# EAGLE board BEP32_6panel_Seed_wdrills (EAGLE 6.5.0), part 1 of 4
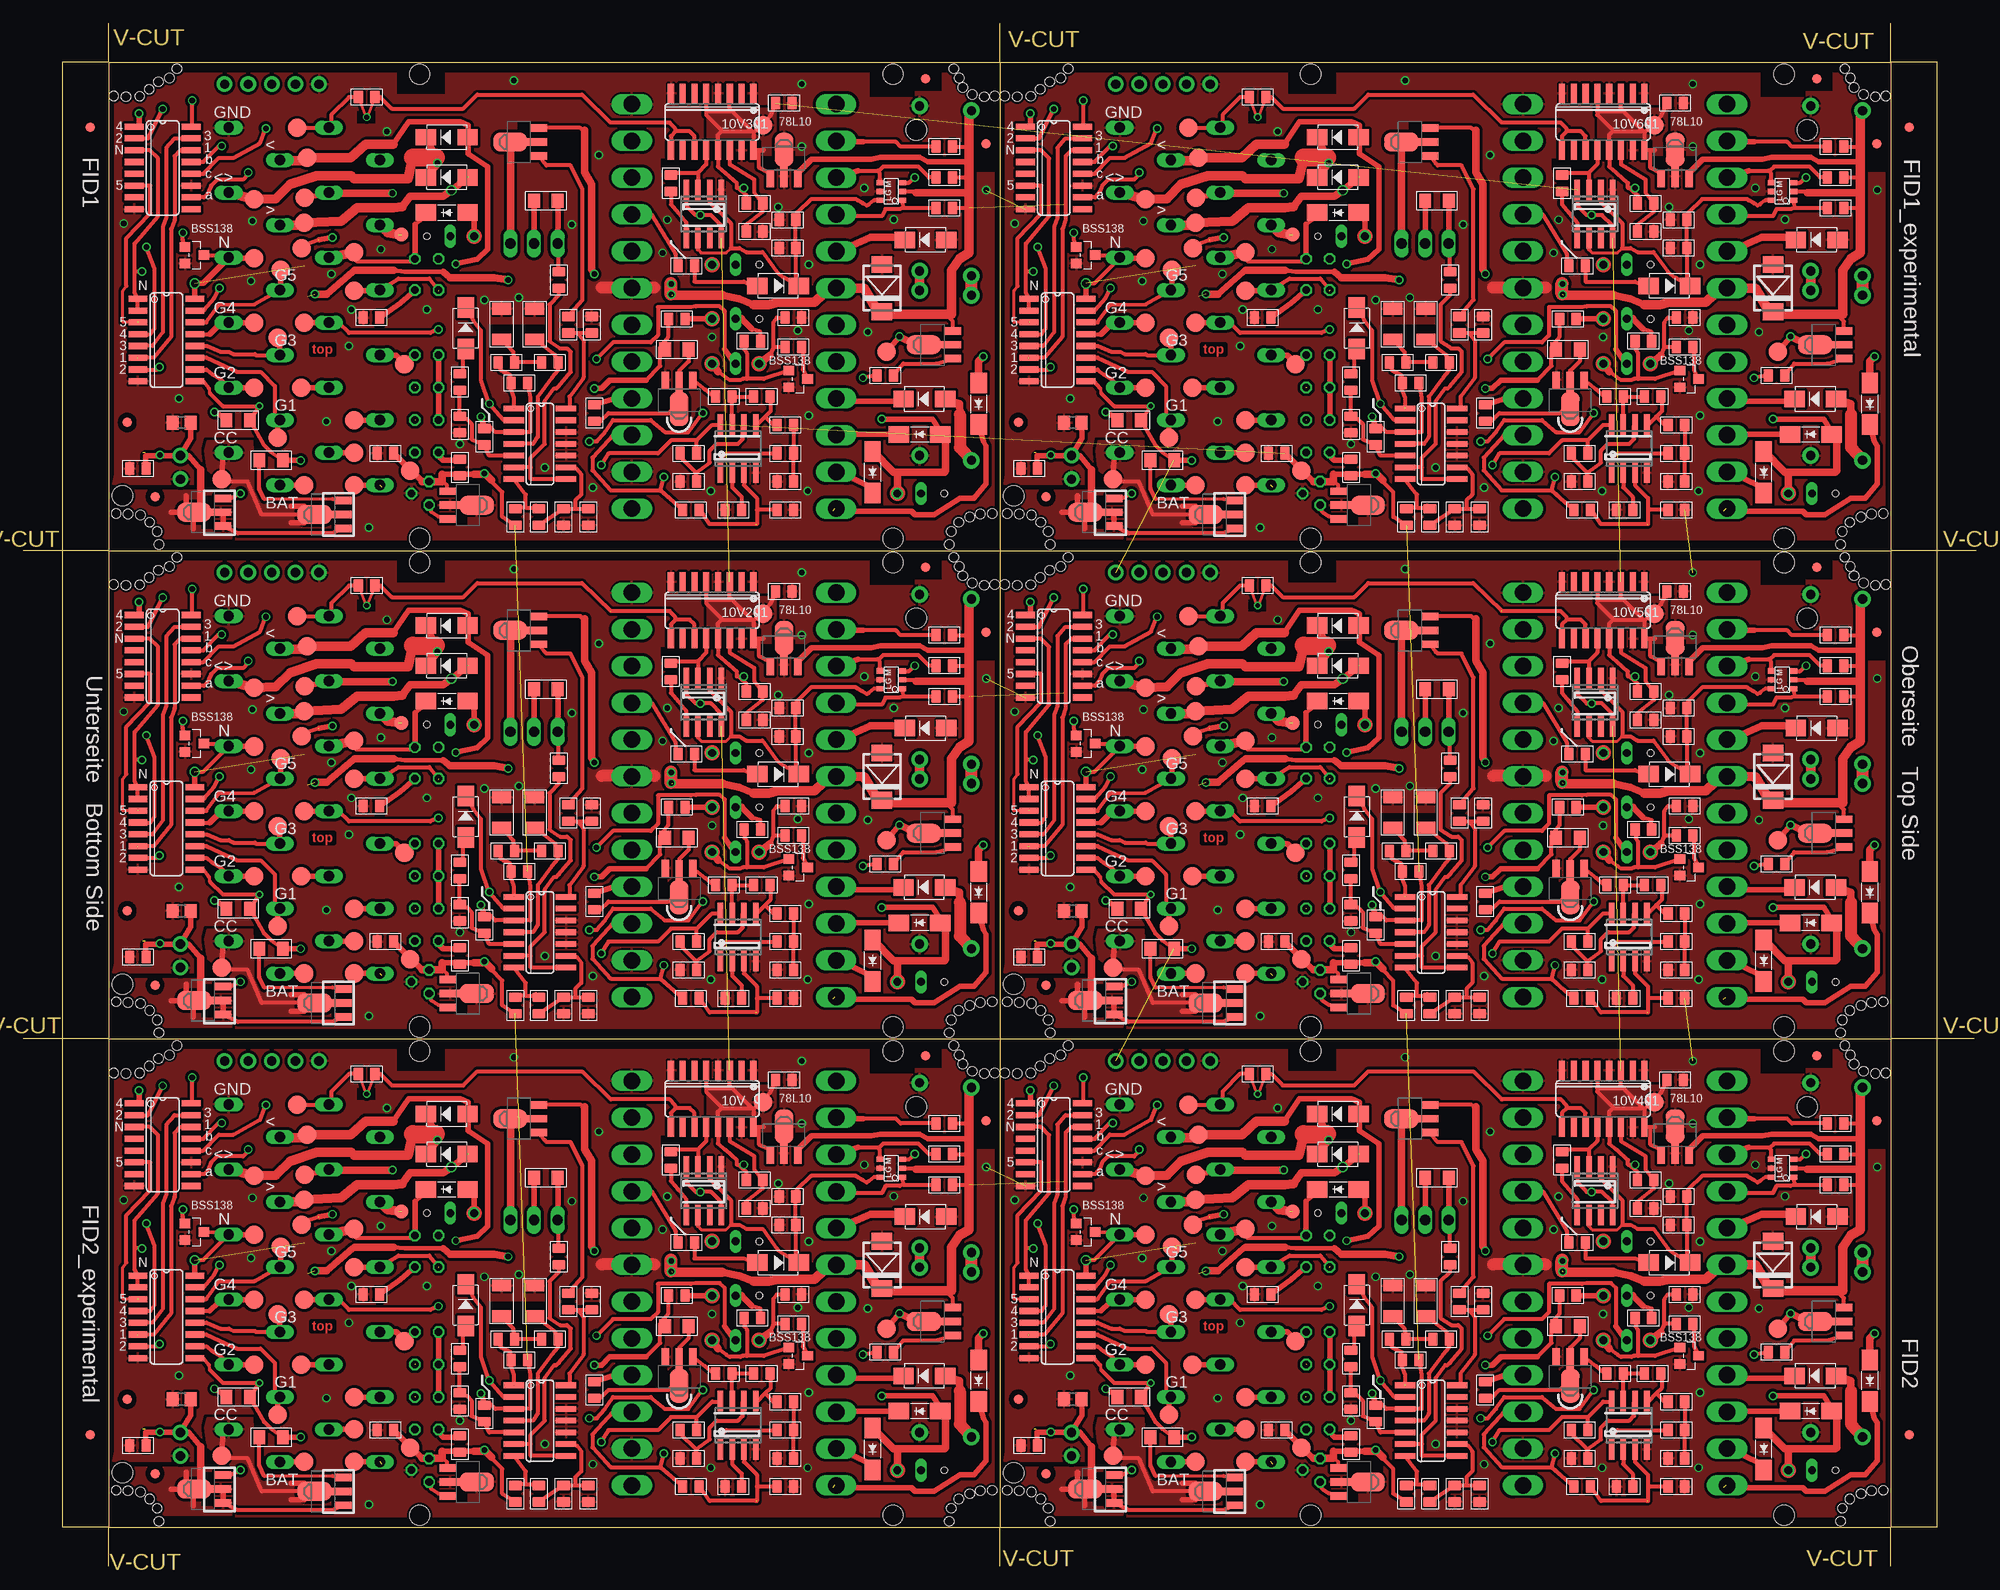
[diagram p12: board, top side]
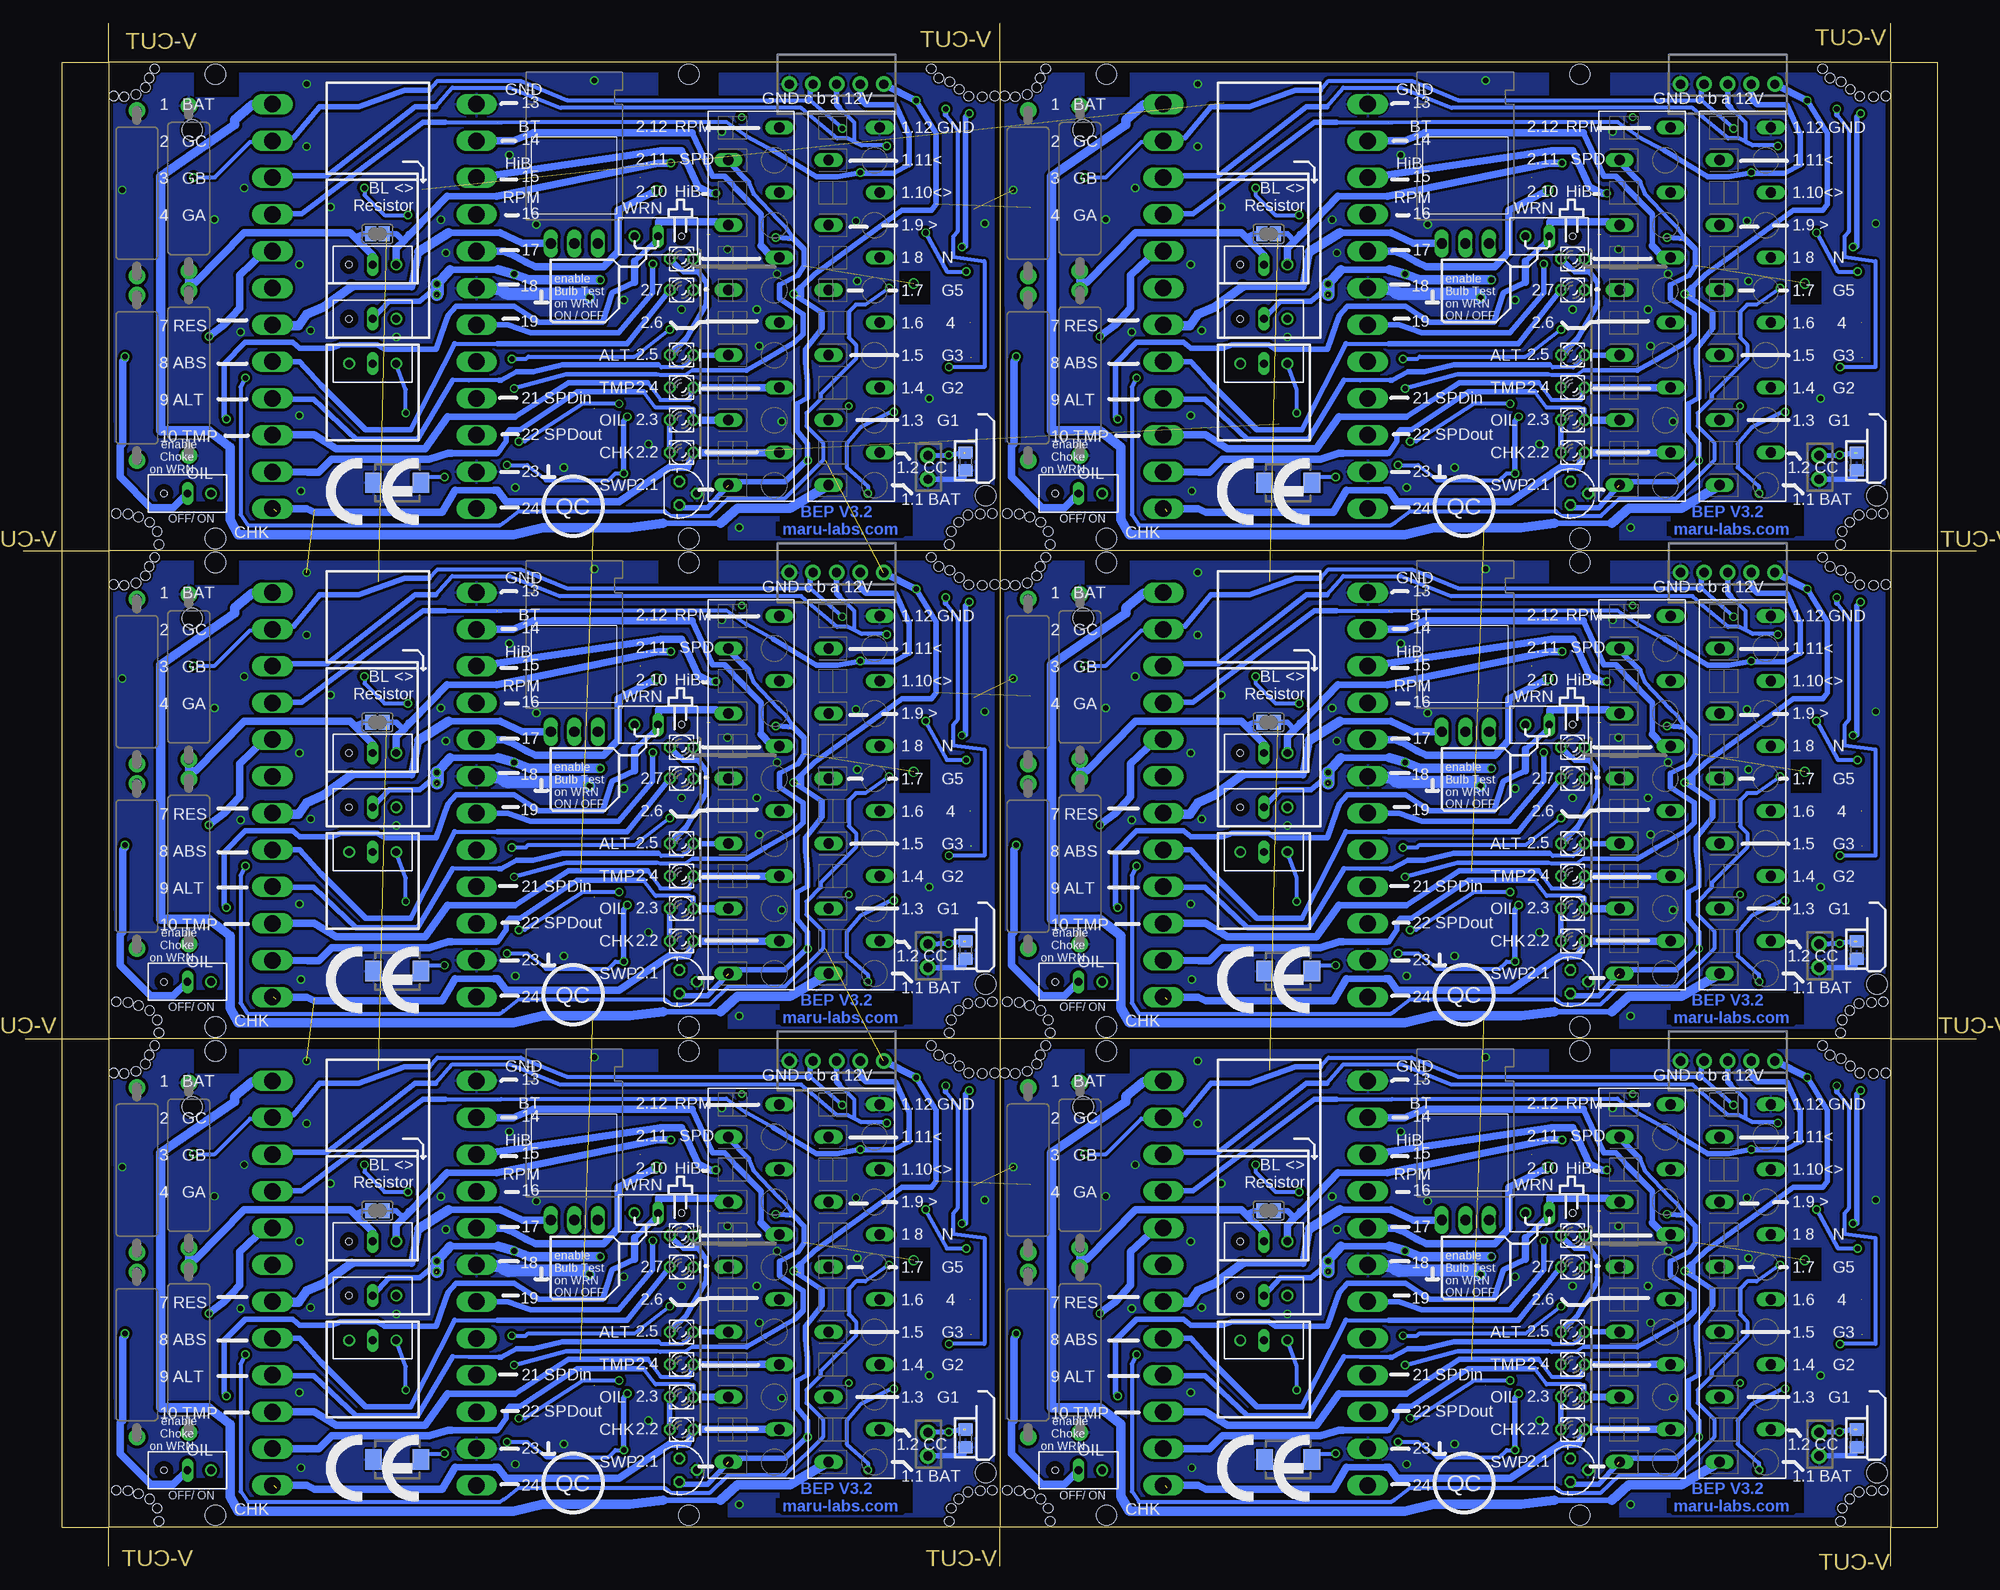
[diagram p13: board, bottom side, seen from below]

Size 210.4 x 166.2 mm. Coordinates in mm from the lower left corner, seen from the top.
Outline: 41 segments
Copper layers (1*16): Top 0.035mm / dielectric 1.5mm / Bottom 0.035mm
Design rules "Vorlage BEP3 und hoeher multi-cb_035um-cu": minimum track width 6mil, minimum drill 12mil, track to track 12mil, track to pad 12mil, pad to pad 6mil, via to via 6mil, smd to smd 6mil, copper to edge 10mil, drill to drill 8mil, minimum pad ring 8mil, minimum via ring 6mil, stop-mask expansion 3mil, vias tented up to drill 0mil, thermal gap 8mil
Holes 1.02 mm at 10.01,8.21 11.28,8.14 12.63,8.03 13.63,7.25 14.44,6.27 104.65,53.16 103.51,53.07 102.24,53.33 101.23,54.09 104.39,8.21 103.12,8.14 101.97,7.83 100.77,7.25 99.96,6.27 9.75,53.16 11.09,53.07 12.56,53.13 13.57,53.89 100.83,55.09 100.23,56.09 14.57,54.69 15.77,55.09 16.57,56.09 14.64,4.87 99.76,4.87 10.01,60.81 11.28,60.74 12.63,60.63 13.63,59.85 14.44,58.87 104.65,105.76 103.51,105.67 102.24,105.93 101.23,106.69 104.39,60.81 103.12,60.74 101.97,60.43 100.77,59.85 99.96,58.87 9.75,105.76 11.09,105.67 12.56,105.73 13.57,106.49 100.83,107.69 100.23,108.69 14.57,107.29 15.77,107.69 16.57,108.69 14.64,57.47 99.76,57.47 10.01,113.41 11.28,113.34 12.63,113.23 13.63,112.45 14.44,111.47 104.65,158.36 103.51,158.27 102.24,158.53 101.23,159.29 104.39,113.41 103.12,113.34 101.97,113.03 100.77,112.45 99.96,111.47 9.75,158.36 11.09,158.27 12.56,158.33 13.57,159.09 100.83,160.29 100.23,161.29 14.57,159.89 15.77,160.29 16.57,161.29 14.64,110.07 99.76,110.07 106.01,8.21 107.28,8.14 108.63,8.03 109.63,7.25 110.44,6.27 200.65,53.16 199.51,53.07 198.24,53.33 197.23,54.09 200.39,8.21 199.12,8.14 197.97,7.83 196.77,7.25 195.96,6.27 105.75,53.16 107.09,53.07 108.56,53.13 109.57,53.89 196.83,55.09 196.23,56.09 110.57,54.69 111.77,55.09 112.57,56.09 110.64,4.87 195.76,4.87 106.01,60.81 107.28,60.74 108.63,60.63 109.63,59.85 110.44,58.87 200.65,105.76 199.51,105.67 198.24,105.93 197.23,106.69 200.39,60.81 199.12,60.74 197.97,60.43 196.77,59.85 195.96,58.87 105.75,105.76 107.09,105.67 108.56,105.73 109.57,106.49 196.83,107.69 196.23,108.69 110.57,107.29 111.77,107.69 112.57,108.69 110.64,57.47 195.76,57.47 106.01,113.41 107.28,113.34 108.63,113.23 109.63,112.45 110.44,111.47 200.65,158.36 199.51,158.27 198.24,158.53 197.23,159.29 200.39,113.41 199.12,113.34 197.97,113.03 196.77,112.45 195.96,111.47 105.75,158.36 107.09,158.27 108.56,158.33 109.57,159.09 196.83,160.29 196.23,161.29 110.57,159.89 111.77,160.29 112.57,161.29 110.64,110.07 195.76,110.07
Holes 2.18 mm at 10.7,10.1 96.2,49.5 10.7,62.7 96.2,102.1 10.7,115.3 96.2,154.7 106.7,10.1 192.2,49.5 106.7,62.7 192.2,102.1 106.7,115.3 192.2,154.7
Holes 2.2 mm at 93.7,5.5 42.7,5.5 42.7,55.5 93.7,55.5 93.7,58.1 42.7,58.1 42.7,108.1 93.7,108.1 93.7,110.7 42.7,110.7 42.7,160.7 93.7,160.7 189.7,5.5 138.7,5.5 138.7,55.5 189.7,55.5 189.7,58.1 138.7,58.1 138.7,108.1 189.7,108.1 189.7,110.7 138.7,110.7 138.7,160.7 189.7,160.7
tRestrict: area 50.2,25.2 to 56.7,28.5; area 36,50.2 to 37.9,51.5; area 67.6,20.8 to 69.4,22.8; area 53.3,46.1 to 54.7,50.4; area 46.5,6.9 to 47.8,11.4; area 47.8,10.1 to 50.5,11.3; area 19.2,6.6 to 20.6,10.1; area 79.5,45.4 to 84.2,46.7; area 97.6,26.6 to 99.2,27.8; area 90.3,42.2 to 91.4,42.4; area 102.7,45 to 104.6,47.2; area 95.6,53.7 to 98.9,56.4; 78 more areas
bRestrict: area 18.6,5.8 to 28.8,9.3; area 28.7,5.8 to 33.3,7.3; area 38.5,5.1 to 45,7.3; area 39.5,53.3 to 46,55.7; area 90.8,5.7 to 96.8,9.5; area 16.7,30.7 to 20,34.3; area 91.2,53.1 to 96,56.1; area 18.6,58.4 to 28.8,62; area 28.7,58.4 to 33.3,59.9; area 38.5,57.7 to 45,59.9; area 39.5,105.9 to 46,108.3; area 90.8,58.3 to 96.8,62.1; 30 more areas

## Footprints (pad centres in the part's own frame; a part is rotated, then mirrored left to right if it is on the bottom)
12-PIN = drill 1.118 long: 1 19.25,-2.45; 2 15.75,3.05; 3 12.25,-2.45; 4 8.75,3.05; 5 5.25,-2.45; 6 1.75,3.05; 7 -1.75,-2.45; 8 -5.25,3.05; 9 -8.75,-2.45; 10 -12.25,3.05; 11 -15.75,-2.45; 12 -19.25,3.05
B2.0 = smd 2 x 2: TP 0,0
C0805 = smd 1.397 x 1.016: 1 0,0.889; 2 0,-0.889
C1206 = smd 1.27 x 2.032: 1 -1.651,0; 2 1.651,0
DO214AA = smd 1.8 x 2.2: A 2.55,0; C -2.55,0
DO-214AC = smd 2.2 x 1.77: 1 -2.242,0; 2 2.242,0
DO214AA_BI = smd 1.8 x 2.2: A 2.45,0; C -2.65,0
DO-214AC_SLIM = smd 2.2 x 1.77: 1 -2.242,0; 2 2.242,0
FIDUCIAL_1MM = smd 1 x 1: 1 0,0
FIDUCIAL_1MM_WITH_SOLDERMASK = smd 1 x 1: 1 0,0
SO08 = smd 0.6 x 2.2: 1 -1.905,-2.6; 2 -0.635,-2.6; 3 0.635,-2.6; 4 1.905,-2.6; 5 1.905,2.6; 6 0.635,2.6; 7 -0.635,2.6; 8 -1.905,2.6
SOT89_ROUND = smd 0.8 x 1.8: 1 -1.499,-2.181; 3 1.499,-2.181 | smd 0.8 x 2.3: 2 0,-1.927 | smd 2.032 x 3.65: 2@1 0,0.94
78LXX = drill 0.813 octagon: GND 0,1.905; IN 1.27,0; OUT -1.27,0
SO16 = smd 0.66 x 2.032: 1 -4.445,-3.073; 2 -3.175,-3.073; 3 -1.905,-3.073; 4 -0.635,-3.073; 5 0.635,-3.073; 6 1.905,-3.073; 7 3.175,-3.073; 8 4.445,-3.073; 9 4.445,3.073; 10 3.175,3.073; 11 1.905,3.073; 12 0.635,3.073; 13 -0.635,3.073; 14 -1.905,3.073; 15 -3.175,3.073; 16 -4.445,3.073
SOT457R_PHILIPS = smd 0.55 x 0.8: 1 -0.95,-1.2; 2 0,-1.2; 3 0.95,-1.2; 4 0.95,1.2; 5 0,1.2; 6 -0.95,1.2
SO14 = smd 0.6 x 2.2: 1 -3.81,-2.8; 2 -2.54,-2.8; 3 -1.27,-2.8; 4 0,-2.8; 5 1.27,-2.8; 6 2.54,-2.8; 7 3.81,-2.8; 8 3.81,2.8; 9 2.54,2.8; 10 1.27,2.8; 11 0,2.8; 12 -1.27,2.8; 13 -2.54,2.8; 14 -3.81,2.8
TO220H_NOHOLE = drill 1.118 long: 1 -2.54,-10.16; 2 0,-10.16; 3 2.54,-10.16
JP2_SMALLPADS = drill 0.85: 1 -2.54,0 | drill 0.85 long: 2 0,0 | hole 0.7: 2.54,0
JP2_ORIG_SMALLPADS = drill 0.85: 1 -2.54,0; 3 2.54,0 | drill 0.85 long: 2 0,0
LD260 = drill 0.813 octagon: A -1.27,0; K 1.27,0
SOT89 = smd 0.8 x 1.8: 1 -1.499,-2.181; 3 1.499,-2.181 | smd 0.8 x 2.3: 2 0,-1.927 | smd 2.032 x 3.65: 2@1 0,0.94
SOT-23 = smd 1.016 x 1.143: 1 -0.889,-1.016; 2 0.889,-1.016; 3 0,1.016
R0805 = smd 1.397 x 1.016: 1 0,0.889; 2 0,-0.889
R1206 = smd 1.27 x 1.524: 1 -1.27,0; 2 1.27,0
R0805' = smd 1.3 x 1.5: 1 -0.95,0; 2 0.95,0
V235/17_1MM = drill 1 pad 1.778: 1 -8.89,0; 2 8.89,0
SJ = smd 1.2 x 1.6: 1 -0.725,0; 2 0.725,0
B1,27 = smd 1.5 x 1.5: TP 0,0
24-PIN_V2 = drill 1.778 long: 1 -21.78,-11; 2 -17.82,-11; 3 -13.86,-11; 4 -9.9,-11; 5 -5.94,-11; 6 -1.98,-11; 7 1.98,-11; 8 5.94,-11; 9 9.9,-11; 10 13.86,-11; 11 17.82,-11; 12 21.78,-11; 13 -21.78,11; 14 -17.82,11; 15 -13.86,11; 16 -9.9,11; 17 -5.94,11; 18 -1.98,11; 19 1.98,11; 20 5.94,11; 21 9.9,11; 22 13.86,11; 23 17.82,11; 24 21.78,11
22-23-2021 = drill 1 pad 1.676: 1 -1.27,0; 2 1.27,0
22-23-2051 = drill 1 pad 1.676: 1 -5.08,0; 2 -2.54,0; 3 0,0; 4 2.54,0; 5 5.08,0

## Placement (x,y rotation side)
1  [12-PIN]  25.19,30.5 270 bottom
2  [12-PIN]  35.98,30.5 270 bottom
3  [12-PIN]  25.19,83.1 270 bottom
4  [12-PIN]  35.98,83.1 270 bottom
5  [12-PIN]  25.19,135.7 270 bottom
6  [12-PIN]  35.98,135.7 270 bottom
6V  TPSB2.0  [B2.0]  41.7,12.78 0 top
6V201  TPSB2.0  [B2.0]  41.7,65.38 0 top
6V301  TPSB2.0  [B2.0]  41.7,117.98 0 top
6V401  TPSB2.0  [B2.0]  137.7,12.78 0 top
6V501  TPSB2.0  [B2.0]  137.7,65.38 0 top
6V601  TPSB2.0  [B2.0]  137.7,117.98 0 top
10V  TPSB2.0  [B2.0]  79.7,50 0 top
10V201  TPSB2.0  [B2.0]  79.7,102.6 0 top
10V301  TPSB2.0  [B2.0]  79.7,155.2 0 top
10V401  TPSB2.0  [B2.0]  175.7,50 0 top
10V501  TPSB2.0  [B2.0]  175.7,102.6 0 top
10V601  TPSB2.0  [B2.0]  175.7,155.2 0 top
13  [12-PIN]  121.19,30.5 270 bottom
14  [12-PIN]  131.98,30.5 270 bottom
15  [12-PIN]  121.19,83.1 270 bottom
16  [12-PIN]  131.98,83.1 270 bottom
17  [12-PIN]  121.19,135.7 270 bottom
18  [12-PIN]  131.98,135.7 270 bottom
C101  4.7u  [C0805]  82.09,8.59 90 top
C102  100nF  [C0805]  81.96,52.4 90 top
C103  100nF,  [C0805]  82.09,11.64 270 top
C104  100nF,  [C0805]  39.03,14.68 270 top
C105  100nF.  [C0805]  58.21,7.83 0 top
C106  100nF.  [C0805]  61.26,28.53 0 top
C107  100u  [C1206]  51.54,28.59 90 top
C108  100u  [C1206]  55.1,28.59 90 top
C109  2.2nF  [C0805]  82.34,36.78 90 top
C110  100nF  [C0805]  78.78,38.56 90 top
C201  4.7u  [C0805]  82.09,61.19 90 top
C202  100nF  [C0805]  81.96,105 90 top
C203  100nF,  [C0805]  82.09,64.24 270 top
C204  100nF,  [C0805]  39.03,67.28 270 top
C205  100nF.  [C0805]  58.21,60.43 0 top
C206  100nF.  [C0805]  61.26,81.13 0 top
C207  100u  [C1206]  51.54,81.19 90 top
C208  100u  [C1206]  55.1,81.19 90 top
C209  2.2nF  [C0805]  82.34,89.38 90 top
C210  100nF  [C0805]  78.78,91.16 90 top
C301  4.7u  [C0805]  82.09,113.79 90 top
C302  100nF  [C0805]  81.96,157.6 90 top
C303  100nF,  [C0805]  82.09,116.84 270 top
C304  100nF,  [C0805]  39.03,119.88 270 top
C305  100nF.  [C0805]  58.21,113.03 0 top
C306  100nF.  [C0805]  61.26,133.73 0 top
C307  100u  [C1206]  51.54,133.79 90 top
C308  100u  [C1206]  55.1,133.79 90 top
C309  2.2nF  [C0805]  82.34,141.98 90 top
C310  100nF  [C0805]  78.78,143.76 90 top
C401  4.7u  [C0805]  178.09,8.59 90 top
C402  100nF  [C0805]  177.96,52.4 90 top
C403  100nF,  [C0805]  178.09,11.64 270 top
C404  100nF,  [C0805]  135.03,14.68 270 top
C405  100nF.  [C0805]  154.21,7.83 0 top
C406  100nF.  [C0805]  157.26,28.53 0 top
C407  100u  [C1206]  147.54,28.59 90 top
C408  100u  [C1206]  151.1,28.59 90 top
C409  2.2nF  [C0805]  178.34,36.78 90 top
C410  100nF  [C0805]  174.78,38.56 90 top
C501  4.7u  [C0805]  178.09,61.19 90 top
C502  100nF  [C0805]  177.96,105 90 top
C503  100nF,  [C0805]  178.09,64.24 270 top
C504  100nF,  [C0805]  135.03,67.28 270 top
C505  100nF.  [C0805]  154.21,60.43 0 top
C506  100nF.  [C0805]  157.26,81.13 0 top
C507  100u  [C1206]  147.54,81.19 90 top
C508  100u  [C1206]  151.1,81.19 90 top
C509  2.2nF  [C0805]  178.34,89.38 90 top
C510  100nF  [C0805]  174.78,91.16 90 top
C601  4.7u  [C0805]  178.09,113.79 90 top
C602  100nF  [C0805]  177.96,157.6 90 top
C603  100nF,  [C0805]  178.09,116.84 270 top
C604  100nF,  [C0805]  135.03,119.88 270 top
C605  100nF.  [C0805]  154.21,113.03 0 top
C606  100nF.  [C0805]  157.26,133.73 0 top
C607  100u  [C1206]  147.54,133.79 90 top
C608  100u  [C1206]  151.1,133.79 90 top
C609  2.2nF  [C0805]  178.34,141.98 90 top
C610  100nF  [C0805]  174.78,143.76 90 top
D101  SM6T  [DO214AA]  92.5,32.46 90 top
D102  1N4007,  [DO-214AC]  45.64,44.4 180 top
D103  1N4007,  [DO-214AC]  45.64,48.72 180 top
D104  SM6TDO214AA_BI  [DO214AA_BI]  74.21,11.51 180 bottom
D105  1N4007.  [DO-214AC]  97.2,37.67 180 top
D106  1N4007.  [DO-214AC]  97.07,20.53 180 top
D107  1N5817  [DO-214AC_SLIM]  96.56,16.72 180 top
D108  1N5817.  [DO-214AC_SLIM]  91.5,12.64 270 top
D109  1N5817.  [DO-214AC_SLIM]  102.93,20.01 270 top
D110  1N5817  [DO-214AC_SLIM]  45.64,40.59 180 top
D111  1N4007  [DO-214AC]  47.67,28.15 90 top
D112  1N4007  [DO-214AC]  81.32,32.72 0 top
D201  SM6T  [DO214AA]  92.5,85.06 90 top
D202  1N4007,  [DO-214AC]  45.64,97 180 top
D203  1N4007,  [DO-214AC]  45.64,101.32 180 top
D204  SM6TDO214AA_BI  [DO214AA_BI]  74.21,64.11 180 bottom
D205  1N4007.  [DO-214AC]  97.2,90.27 180 top
D206  1N4007.  [DO-214AC]  97.07,73.13 180 top
D207  1N5817  [DO-214AC_SLIM]  96.56,69.32 180 top
D208  1N5817.  [DO-214AC_SLIM]  91.5,65.24 270 top
D209  1N5817.  [DO-214AC_SLIM]  102.93,72.61 270 top
D210  1N5817  [DO-214AC_SLIM]  45.64,93.19 180 top
D211  1N4007  [DO-214AC]  47.67,80.75 90 top
D212  1N4007  [DO-214AC]  81.32,85.32 0 top
D301  SM6T  [DO214AA]  92.5,137.66 90 top
D302  1N4007,  [DO-214AC]  45.64,149.6 180 top
D303  1N4007,  [DO-214AC]  45.64,153.92 180 top
D304  SM6TDO214AA_BI  [DO214AA_BI]  74.21,116.71 180 bottom
D305  1N4007.  [DO-214AC]  97.2,142.87 180 top
D306  1N4007.  [DO-214AC]  97.07,125.73 180 top
D307  1N5817  [DO-214AC_SLIM]  96.56,121.92 180 top
D308  1N5817.  [DO-214AC_SLIM]  91.5,117.84 270 top
D309  1N5817.  [DO-214AC_SLIM]  102.93,125.21 270 top
D310  1N5817  [DO-214AC_SLIM]  45.64,145.79 180 top
D311  1N4007  [DO-214AC]  47.67,133.35 90 top
D312  1N4007  [DO-214AC]  81.32,137.92 0 top
D401  SM6T  [DO214AA]  188.5,32.46 90 top
D402  1N4007,  [DO-214AC]  141.64,44.4 180 top
D403  1N4007,  [DO-214AC]  141.64,48.72 180 top
D404  SM6TDO214AA_BI  [DO214AA_BI]  170.21,11.51 180 bottom
D405  1N4007.  [DO-214AC]  193.2,37.67 180 top
D406  1N4007.  [DO-214AC]  193.07,20.53 180 top
D407  1N5817  [DO-214AC_SLIM]  192.56,16.72 180 top
D408  1N5817.  [DO-214AC_SLIM]  187.5,12.64 270 top
D409  1N5817.  [DO-214AC_SLIM]  198.93,20.01 270 top
D410  1N5817  [DO-214AC_SLIM]  141.64,40.59 180 top
D411  1N4007  [DO-214AC]  143.67,28.15 90 top
D412  1N4007  [DO-214AC]  177.32,32.72 0 top
D501  SM6T  [DO214AA]  188.5,85.06 90 top
D502  1N4007,  [DO-214AC]  141.64,97 180 top
D503  1N4007,  [DO-214AC]  141.64,101.32 180 top
D504  SM6TDO214AA_BI  [DO214AA_BI]  170.21,64.11 180 bottom
D505  1N4007.  [DO-214AC]  193.2,90.27 180 top
D506  1N4007.  [DO-214AC]  193.07,73.13 180 top
D507  1N5817  [DO-214AC_SLIM]  192.56,69.32 180 top
D508  1N5817.  [DO-214AC_SLIM]  187.5,65.24 270 top
D509  1N5817.  [DO-214AC_SLIM]  198.93,72.61 270 top
D510  1N5817  [DO-214AC_SLIM]  141.64,93.19 180 top
D511  1N4007  [DO-214AC]  143.67,80.75 90 top
D512  1N4007  [DO-214AC]  177.32,85.32 0 top
D601  SM6T  [DO214AA]  188.5,137.66 90 top
D602  1N4007,  [DO-214AC]  141.64,149.6 180 top
D603  1N4007,  [DO-214AC]  141.64,153.92 180 top
D604  SM6TDO214AA_BI  [DO214AA_BI]  170.21,116.71 180 bottom
D605  1N4007.  [DO-214AC]  193.2,142.87 180 top
D606  1N4007.  [DO-214AC]  193.07,125.73 180 top
D607  1N5817  [DO-214AC_SLIM]  192.56,121.92 180 top
D608  1N5817.  [DO-214AC_SLIM]  187.5,117.84 270 top
D609  1N5817.  [DO-214AC_SLIM]  198.93,125.21 270 top
D610  1N5817  [DO-214AC_SLIM]  141.64,145.79 180 top
D611  1N4007  [DO-214AC]  143.67,133.35 90 top
D612  1N4007  [DO-214AC]  177.32,137.92 0 top
FID1  FIDUCIAL  [FIDUCIAL_1MM]  7.2,155 0 top
FID1B  FIDUCIALFIDUCIAL_1MM_WITH_SOLDERMASK  [FIDUCIAL_1MM_WITH_SOLDERMASK]  203.2,155 0 top
FID2  FIDUCIAL  [FIDUCIAL_1MM]  203.2,14.2 0 top
FID2B  FIDUCIALFIDUCIAL_1MM_WITH_SOLDERMASK  [FIDUCIAL_1MM_WITH_SOLDERMASK]  7.2,14.2 0 top
FID101  FIDUCIAL  [FIDUCIAL_1MM]  97.2,55 0 top
FID102  FIDUCIAL  [FIDUCIAL_1MM]  11.2,18 0 top
FID103  FIDUCIAL  [FIDUCIAL_1MM]  14.2,10 0 top
FID104  FIDUCIAL  [FIDUCIAL_1MM]  103.7,48 0 top
FID201  FIDUCIAL  [FIDUCIAL_1MM]  97.2,107.6 0 top
FID202  FIDUCIAL  [FIDUCIAL_1MM]  11.2,70.6 0 top
FID203  FIDUCIAL  [FIDUCIAL_1MM]  14.2,62.6 0 top
FID204  FIDUCIAL  [FIDUCIAL_1MM]  103.7,100.6 0 top
FID301  FIDUCIAL  [FIDUCIAL_1MM]  97.2,160.2 0 top
FID302  FIDUCIAL  [FIDUCIAL_1MM]  11.2,123.2 0 top
FID303  FIDUCIAL  [FIDUCIAL_1MM]  14.2,115.2 0 top
FID304  FIDUCIAL  [FIDUCIAL_1MM]  103.7,153.2 0 top
FID401  FIDUCIAL  [FIDUCIAL_1MM]  193.2,55 0 top
FID402  FIDUCIAL  [FIDUCIAL_1MM]  107.2,18 0 top
FID403  FIDUCIAL  [FIDUCIAL_1MM]  110.2,10 0 top
FID404  FIDUCIAL  [FIDUCIAL_1MM]  199.7,48 0 top
FID501  FIDUCIAL  [FIDUCIAL_1MM]  193.2,107.6 0 top
FID502  FIDUCIAL  [FIDUCIAL_1MM]  107.2,70.6 0 top
FID503  FIDUCIAL  [FIDUCIAL_1MM]  110.2,62.6 0 top
FID504  FIDUCIAL  [FIDUCIAL_1MM]  199.7,100.6 0 top
FID601  FIDUCIAL  [FIDUCIAL_1MM]  193.2,160.2 0 top
FID602  FIDUCIAL  [FIDUCIAL_1MM]  107.2,123.2 0 top
FID603  FIDUCIAL  [FIDUCIAL_1MM]  110.2,115.2 0 top
FID604  FIDUCIAL  [FIDUCIAL_1MM]  199.7,153.2 0 top
IC101  LM2904  [SO08]  77.01,15.19 0 top
IC102  78L06  [SOT89_ROUND]  47.92,9.1 270 top
IC103  6V pos  [78LXX]  43.73,10.37 270 bottom
IC104  78L10  [SOT89_ROUND]  81.96,46.43 0 top
IC105  4028  [SO16]  15.03,45.42 270 top
IC106  NUP4304SOT457_R  [SOT457R_PHILIPS]  93.52,42.88 90 top
IC107  ULN2004  [SO16]  15.43,26.88 270 top
IC108  LM339  [SO14]  55.67,15.7 270 top
IC109  317TO202H_NOHOLE  [TO220H_NOHOLE]  55.03,47.45 0 bottom
IC110  555  [SO08]  73.32,40.47 180 top
IC111  4538  [SO16]  74.21,50.37 180 top
IC201  LM2904  [SO08]  77.01,67.79 0 top
IC202  78L06  [SOT89_ROUND]  47.92,61.7 270 top
IC203  6V pos  [78LXX]  43.73,62.97 270 bottom
IC204  78L10  [SOT89_ROUND]  81.96,99.03 0 top
IC205  4028  [SO16]  15.03,98.02 270 top
IC206  NUP4304SOT457_R  [SOT457R_PHILIPS]  93.52,95.48 90 top
IC207  ULN2004  [SO16]  15.43,79.48 270 top
IC208  LM339  [SO14]  55.67,68.3 270 top
IC209  317TO202H_NOHOLE  [TO220H_NOHOLE]  55.03,100.05 0 bottom
IC210  555  [SO08]  73.32,93.06 180 top
IC211  4538  [SO16]  74.21,102.97 180 top
IC301  LM2904  [SO08]  77.01,120.39 0 top
IC302  78L06  [SOT89_ROUND]  47.92,114.3 270 top
IC303  6V pos  [78LXX]  43.73,115.57 270 bottom
IC304  78L10  [SOT89_ROUND]  81.96,151.63 0 top
IC305  4028  [SO16]  15.03,150.62 270 top
IC306  NUP4304SOT457_R  [SOT457R_PHILIPS]  93.52,148.08 90 top
IC307  ULN2004  [SO16]  15.43,132.08 270 top
IC308  LM339  [SO14]  55.67,120.9 270 top
IC309  317TO202H_NOHOLE  [TO220H_NOHOLE]  55.03,152.65 0 bottom
IC310  555  [SO08]  73.32,145.66 180 top
IC311  4538  [SO16]  74.21,155.57 180 top
IC401  LM2904  [SO08]  173.01,15.19 0 top
IC402  78L06  [SOT89_ROUND]  143.92,9.1 270 top
IC403  6V pos  [78LXX]  139.73,10.37 270 bottom
IC404  78L10  [SOT89_ROUND]  177.96,46.43 0 top
IC405  4028  [SO16]  111.03,45.42 270 top
IC406  NUP4304SOT457_R  [SOT457R_PHILIPS]  189.52,42.88 90 top
IC407  ULN2004  [SO16]  111.43,26.88 270 top
IC408  LM339  [SO14]  151.67,15.7 270 top
IC409  317TO202H_NOHOLE  [TO220H_NOHOLE]  151.03,47.45 0 bottom
IC410  555  [SO08]  169.32,40.47 180 top
IC411  4538  [SO16]  170.21,50.37 180 top
IC501  LM2904  [SO08]  173.01,67.79 0 top
IC502  78L06  [SOT89_ROUND]  143.92,61.7 270 top
IC503  6V pos  [78LXX]  139.73,62.97 270 bottom
IC504  78L10  [SOT89_ROUND]  177.96,99.03 0 top
IC505  4028  [SO16]  111.03,98.02 270 top
IC506  NUP4304SOT457_R  [SOT457R_PHILIPS]  189.52,95.48 90 top
IC507  ULN2004  [SO16]  111.43,79.48 270 top
IC508  LM339  [SO14]  151.67,68.3 270 top
IC509  317TO202H_NOHOLE  [TO220H_NOHOLE]  151.03,100.05 0 bottom
IC510  555  [SO08]  169.32,93.06 180 top
IC511  4538  [SO16]  170.21,102.97 180 top
IC601  LM2904  [SO08]  173.01,120.39 0 top
IC602  78L06  [SOT89_ROUND]  143.92,114.3 270 top
IC603  6V pos  [78LXX]  139.73,115.57 270 bottom
IC604  78L10  [SOT89_ROUND]  177.96,151.63 0 top
IC605  4028  [SO16]  111.03,150.62 270 top
IC606  NUP4304SOT457_R  [SOT457R_PHILIPS]  189.52,148.08 90 top
IC607  ULN2004  [SO16]  111.43,132.08 270 top
IC608  LM339  [SO14]  151.67,120.9 270 top
IC609  317TO202H_NOHOLE  [TO220H_NOHOLE]  151.03,152.65 0 bottom
IC610  555  [SO08]  169.32,145.66 180 top
IC611  4538  [SO16]  170.21,155.57 180 top
JP101  [JP2_SMALLPADS]  76.75,29.16 180 bottom
JP102  [JP2_SMALLPADS]  96.7,10.35 180 bottom
JP103  [JP2_SMALLPADS]  46.02,38.05 0 bottom
JP104  [JP2_SMALLPADS]  76.75,35 180 bottom
JP105  JP2E_ORIG  [JP2_ORIG_SMALLPADS]  76.75,24.34 180 bottom
JP201  [JP2_SMALLPADS]  76.75,81.76 180 bottom
JP202  [JP2_SMALLPADS]  96.7,62.95 180 bottom
JP203  [JP2_SMALLPADS]  46.02,90.65 0 bottom
JP204  [JP2_SMALLPADS]  76.75,87.6 180 bottom
JP205  JP2E_ORIG  [JP2_ORIG_SMALLPADS]  76.75,76.94 180 bottom
JP301  [JP2_SMALLPADS]  76.75,134.36 180 bottom
JP302  [JP2_SMALLPADS]  96.7,115.55 180 bottom
JP303  [JP2_SMALLPADS]  46.02,143.25 0 bottom
JP304  [JP2_SMALLPADS]  76.75,140.2 180 bottom
JP305  JP2E_ORIG  [JP2_ORIG_SMALLPADS]  76.75,129.54 180 bottom
JP401  [JP2_SMALLPADS]  172.75,29.16 180 bottom
JP402  [JP2_SMALLPADS]  192.7,10.35 180 bottom
JP403  [JP2_SMALLPADS]  142.02,38.05 0 bottom
JP404  [JP2_SMALLPADS]  172.75,35 180 bottom
JP405  JP2E_ORIG  [JP2_ORIG_SMALLPADS]  172.75,24.34 180 bottom
JP501  [JP2_SMALLPADS]  172.75,81.76 180 bottom
JP502  [JP2_SMALLPADS]  192.7,62.95 180 bottom
JP503  [JP2_SMALLPADS]  142.02,90.65 0 bottom
JP504  [JP2_SMALLPADS]  172.75,87.6 180 bottom
JP505  JP2E_ORIG  [JP2_ORIG_SMALLPADS]  172.75,76.94 180 bottom
JP601  [JP2_SMALLPADS]  172.75,134.36 180 bottom
JP602  [JP2_SMALLPADS]  192.7,115.55 180 bottom
JP603  [JP2_SMALLPADS]  142.02,143.25 0 bottom
JP604  [JP2_SMALLPADS]  172.75,140.2 180 bottom
JP605  JP2E_ORIG  [JP2_ORIG_SMALLPADS]  172.75,129.54 180 bottom
LED101  [LD260]  43.48,32.25 0 bottom
LED102  [LD260]  43.48,14.75 0 bottom
LED103  [LD260]  43.48,18.25 0 bottom
LED104  [LD260]  43.48,21.75 0 bottom
LED105  [LD260]  43.48,25.25 0 bottom
LED106  [LD260]  43.48,35.62 0 bottom
LED201  [LD260]  43.48,84.85 0 bottom
LED202  [LD260]  43.48,67.35 0 bottom
LED203  [LD260]  43.48,70.85 0 bottom
LED204  [LD260]  43.48,74.35 0 bottom
LED205  [LD260]  43.48,77.85 0 bottom
LED206  [LD260]  43.48,88.22 0 bottom
LED301  [LD260]  43.48,137.45 0 bottom
LED302  [LD260]  43.48,119.95 0 bottom
LED303  [LD260]  43.48,123.45 0 bottom
LED304  [LD260]  43.48,126.95 0 bottom
LED305  [LD260]  43.48,130.45 0 bottom
LED306  [LD260]  43.48,140.82 0 bottom
LED401  [LD260]  139.48,32.25 0 bottom
LED402  [LD260]  139.48,14.75 0 bottom
LED403  [LD260]  139.48,18.25 0 bottom
LED404  [LD260]  139.48,21.75 0 bottom
LED405  [LD260]  139.48,25.25 0 bottom
LED406  [LD260]  139.48,35.62 0 bottom
LED501  [LD260]  139.48,84.85 0 bottom
LED502  [LD260]  139.48,67.35 0 bottom
LED503  [LD260]  139.48,70.85 0 bottom
LED504  [LD260]  139.48,74.35 0 bottom
LED505  [LD260]  139.48,77.85 0 bottom
LED506  [LD260]  139.48,88.22 0 bottom
LED601  [LD260]  139.48,137.45 0 bottom
LED602  [LD260]  139.48,119.95 0 bottom
LED603  [LD260]  139.48,123.45 0 bottom
LED604  [LD260]  139.48,126.95 0 bottom
LED605  [LD260]  139.48,130.45 0 bottom
LED606  [LD260]  139.48,140.82 0 bottom
Q101  BA.  [SOT89]  32.3,8.08 90 top
Q102  BA.  [SOT89]  19.35,8.33 90 top
Q103  MY  [SOT89]  70.66,20.4 180 top
Q104  BA  [SOT89]  97.96,26.37 90 top
Q105  BA  [SOT89]  53.38,48.21 90 top
Q106  J1  [SOT-23]  18.46,36.02 270 top
Q107  J1  [SOT-23]  83.48,22.68 270 top
Q201  BA.  [SOT89]  32.3,60.68 90 top
Q202  BA.  [SOT89]  19.35,60.93 90 top
Q203  MY  [SOT89]  70.66,73 180 top
Q204  BA  [SOT89]  97.96,78.97 90 top
Q205  BA  [SOT89]  53.38,100.81 90 top
Q206  J1  [SOT-23]  18.46,88.62 270 top
Q207  J1  [SOT-23]  83.48,75.28 270 top
Q301  BA.  [SOT89]  32.3,113.28 90 top
Q302  BA.  [SOT89]  19.35,113.53 90 top
Q303  MY  [SOT89]  70.66,125.6 180 top
Q304  BA  [SOT89]  97.96,131.57 90 top
Q305  BA  [SOT89]  53.38,153.41 90 top
Q306  J1  [SOT-23]  18.46,141.22 270 top
Q307  J1  [SOT-23]  83.48,127.89 270 top
Q401  BA.  [SOT89]  128.3,8.08 90 top
Q402  BA.  [SOT89]  115.35,8.33 90 top
Q403  MY  [SOT89]  166.66,20.4 180 top
Q404  BA  [SOT89]  193.96,26.37 90 top
Q405  BA  [SOT89]  149.38,48.21 90 top
Q406  J1  [SOT-23]  114.46,36.02 270 top
Q407  J1  [SOT-23]  179.48,22.68 270 top
Q501  BA.  [SOT89]  128.3,60.68 90 top
Q502  BA.  [SOT89]  115.35,60.93 90 top
Q503  MY  [SOT89]  166.66,73 180 top
Q504  BA  [SOT89]  193.96,78.97 90 top
Q505  BA  [SOT89]  149.38,100.81 90 top
Q506  J1  [SOT-23]  114.46,88.62 270 top
Q507  J1  [SOT-23]  179.48,75.28 270 top
Q601  BA.  [SOT89]  128.3,113.28 90 top
Q602  BA.  [SOT89]  115.35,113.53 90 top
Q603  MY  [SOT89]  166.66,125.6 180 top
Q604  BA  [SOT89]  193.96,131.57 90 top
Q605  BA  [SOT89]  149.38,153.41 90 top
Q606  J1  [SOT-23]  114.46,141.22 270 top
Q607  J1  [SOT-23]  179.48,127.89 270 top
R101  102  [R0805]  12.36,13.03 270 top
R102  13  [R1206]  26.71,13.92 180 top
R103  R_user  [R0805']  17.07,17.99 180 top
R104  R_user  [R0805']  12.87,13.79 270 bottom
R105  4701  [R0805]  71.93,8.59 270 top
R106  13  [R1206]  23.16,18.24 180 top
R107  1002  [R0805]  76.5,8.59 90 top
R108  1002  [R0805]  82.09,14.68 270 top
R109  104  [R0805]  99.23,47.7 90 top
R110  104  [R0805]  99.23,44.4 90 top
R111  104  [R0805]  99.23,41.1 90 top
R112  102  [R0805]  82.09,17.73 270 top
R113  102  [R0805]  71.67,14.68 90 top
R114  102  [R0805]  71.67,11.64 90 top
R115  100  [R0805]  61.51,19 0 top
R116  4701  [R0805]  75.48,20.78 270 top
R117  2702  [R0805]  79.55,20.78 90 top
R118  13  [R1206]  70.41,25.86 180 top
R119  2201  [R0805]  70.4,29.16 90 top
R120  1002  [R0805]  57.7,33.35 180 top
R121  1502  [R0805]  53,7.83 0 top
R122  2702  [R0805]  55.54,7.83 0 top
R123  2702  [R0805]  60.88,7.83 180 top
R124  1002  [R0805]  53.45,22.24 270 top
R125  104  [R0805]  52.05,24.46 270 top
R126  4701  [R0805]  58.72,28.53 0 top
R127  47  [V235/17_1MM]  102.15,22.81 90 bottom
R128  102  [R0805]  92.88,23.07 90 top
R129  47  [V235/17_1MM]  102.15,42.69 90 bottom
R130  104  [R0805]  56.75,24.46 270 top
R131  1502  [R0805]  49.7,16.46 180 top
R132  1002  [R0805]  47.03,17.8 180 top
R133  2201  [R0805]  47.03,22.37 0 top
R134  13  [R1206]  56.3,41.86 180 top
R135  104  [R0805]  78.53,26.75 270 top
R136  47  [V235/17_1MM]  96.56,23.32 90 bottom
R137  47  [V235/17_1MM]  96.56,43.2 270 bottom
R138  100  [R0805]  82.98,26.11 90 top
R139  (101)  [R0805]  82.98,29.29 90 top
R140  2702  [R0805]  71.42,34.88 270 top
R141  104  [R0805]  82.34,39.83 270 top
R142  (1000)  [R0805]  47.03,13.16 0 top
R143  (101)  [R0805]  37.51,29.29 270 top
R144  (1002)  [R0805]  69.77,43.77 0 top
R145  2702  [R0805]  78.78,41.61 270 top
R146  (1002)  [R0805]  37,53.04 90 top
R201  102  [R0805]  12.36,65.63 270 top
R202  13  [R1206]  26.71,66.52 180 top
R203  R_user  [R0805']  17.07,70.59 180 top
R204  R_user  [R0805']  12.87,66.4 270 bottom
R205  4701  [R0805]  71.93,61.19 270 top
R206  13  [R1206]  23.16,70.84 180 top
R207  1002  [R0805]  76.5,61.19 90 top
R208  1002  [R0805]  82.09,67.28 270 top
R209  104  [R0805]  99.23,100.3 90 top
R210  104  [R0805]  99.23,97 90 top
R211  104  [R0805]  99.23,93.7 90 top
R212  102  [R0805]  82.09,70.33 270 top
R213  102  [R0805]  71.67,67.28 90 top
R214  102  [R0805]  71.67,64.24 90 top
R215  100  [R0805]  61.51,71.6 0 top
R216  4701  [R0805]  75.48,73.38 270 top
R217  2702  [R0805]  79.55,73.38 90 top
R218  13  [R1206]  70.41,78.46 180 top
R219  2201  [R0805]  70.4,81.76 90 top
R220  1002  [R0805]  57.7,85.95 180 top
R221  1502  [R0805]  53,60.43 0 top
R222  2702  [R0805]  55.54,60.43 0 top
R223  2702  [R0805]  60.88,60.43 180 top
R224  1002  [R0805]  53.45,74.84 270 top
R225  104  [R0805]  52.05,77.06 270 top
R226  4701  [R0805]  58.72,81.13 0 top
R227  47  [V235/17_1MM]  102.15,75.41 90 bottom
R228  102  [R0805]  92.88,75.67 90 top
R229  47  [V235/17_1MM]  102.15,95.29 90 bottom
R230  104  [R0805]  56.75,77.06 270 top
R231  1502  [R0805]  49.7,69.06 180 top
R232  1002  [R0805]  47.03,70.4 180 top
R233  2201  [R0805]  47.03,74.97 0 top
R234  13  [R1206]  56.3,94.46 180 top
R235  104  [R0805]  78.53,79.35 270 top
R236  47  [V235/17_1MM]  96.56,75.92 90 bottom
R237  47  [V235/17_1MM]  96.56,95.8 270 bottom
R238  100  [R0805]  82.98,78.71 90 top
R239  (101)  [R0805]  82.98,81.89 90 top
R240  2702  [R0805]  71.42,87.48 270 top
R241  104  [R0805]  82.34,92.43 270 top
R242  (1000)  [R0805]  47.03,65.76 0 top
R243  (101)  [R0805]  37.51,81.89 270 top
R244  (1002)  [R0805]  69.77,96.37 0 top
R245  2702  [R0805]  78.78,94.21 270 top
R246  (1002)  [R0805]  37,105.64 90 top
R301  102  [R0805]  12.36,118.23 270 top
R302  13  [R1206]  26.71,119.12 180 top
R303  R_user  [R0805']  17.07,123.19 180 top
R304  R_user  [R0805']  12.87,119 270 bottom
R305  4701  [R0805]  71.93,113.79 270 top
R306  13  [R1206]  23.16,123.44 180 top
R307  1002  [R0805]  76.5,113.79 90 top
R308  1002  [R0805]  82.09,119.88 270 top
R309  104  [R0805]  99.23,152.9 90 top
R310  104  [R0805]  99.23,149.6 90 top
R311  104  [R0805]  99.23,146.3 90 top
R312  102  [R0805]  82.09,122.93 270 top
R313  102  [R0805]  71.67,119.88 90 top
R314  102  [R0805]  71.67,116.84 90 top
R315  100  [R0805]  61.51,124.2 0 top
R316  4701  [R0805]  75.48,125.98 270 top
R317  2702  [R0805]  79.55,125.98 90 top
R318  13  [R1206]  70.41,131.06 180 top
R319  2201  [R0805]  70.4,134.36 90 top
R320  1002  [R0805]  57.7,138.55 180 top
R321  1502  [R0805]  53,113.03 0 top
R322  2702  [R0805]  55.54,113.03 0 top
R323  2702  [R0805]  60.88,113.03 180 top
R324  1002  [R0805]  53.45,127.44 270 top
R325  104  [R0805]  52.05,129.66 270 top
R326  4701  [R0805]  58.72,133.73 0 top
R327  47  [V235/17_1MM]  102.15,128.01 90 bottom
R328  102  [R0805]  92.88,128.27 90 top
R329  47  [V235/17_1MM]  102.15,147.89 90 bottom
R330  104  [R0805]  56.75,129.66 270 top
R331  1502  [R0805]  49.7,121.66 180 top
R332  1002  [R0805]  47.03,123 180 top
R333  2201  [R0805]  47.03,127.57 0 top
R334  13  [R1206]  56.3,147.06 180 top
R335  104  [R0805]  78.53,131.95 270 top
R336  47  [V235/17_1MM]  96.56,128.52 90 bottom
R337  47  [V235/17_1MM]  96.56,148.4 270 bottom
R338  100  [R0805]  82.98,131.31 90 top
R339  (101)  [R0805]  82.98,134.49 90 top
R340  2702  [R0805]  71.42,140.08 270 top
R341  104  [R0805]  82.34,145.03 270 top
R342  (1000)  [R0805]  47.03,118.36 0 top
R343  (101)  [R0805]  37.51,134.49 270 top
R344  (1002)  [R0805]  69.77,148.97 0 top
R345  2702  [R0805]  78.78,146.81 270 top
R346  (1002)  [R0805]  37,158.24 90 top
R401  102  [R0805]  108.36,13.03 270 top
R402  13  [R1206]  122.71,13.92 180 top
R403  R_user  [R0805']  113.07,17.99 180 top
R404  R_user  [R0805']  108.87,13.79 270 bottom
R405  4701  [R0805]  167.93,8.59 270 top
R406  13  [R1206]  119.16,18.24 180 top
R407  1002  [R0805]  172.5,8.59 90 top
R408  1002  [R0805]  178.09,14.68 270 top
R409  104  [R0805]  195.23,47.7 90 top
R410  104  [R0805]  195.23,44.4 90 top
R411  104  [R0805]  195.23,41.1 90 top
R412  102  [R0805]  178.09,17.73 270 top
R413  102  [R0805]  167.67,14.68 90 top
R414  102  [R0805]  167.67,11.64 90 top
R415  100  [R0805]  157.51,19 0 top
R416  4701  [R0805]  171.48,20.78 270 top
R417  2702  [R0805]  175.55,20.78 90 top
R418  13  [R1206]  166.41,25.86 180 top
R419  2201  [R0805]  166.4,29.16 90 top
R420  1002  [R0805]  153.7,33.35 180 top
R421  1502  [R0805]  149,7.83 0 top
R422  2702  [R0805]  151.54,7.83 0 top
R423  2702  [R0805]  156.88,7.83 180 top
R424  1002  [R0805]  149.45,22.24 270 top
R425  104  [R0805]  148.05,24.46 270 top
R426  4701  [R0805]  154.72,28.53 0 top
R427  47  [V235/17_1MM]  198.15,22.81 90 bottom
R428  102  [R0805]  188.88,23.07 90 top
R429  47  [V235/17_1MM]  198.15,42.69 90 bottom
R430  104  [R0805]  152.75,24.46 270 top
R431  1502  [R0805]  145.7,16.46 180 top
R432  1002  [R0805]  143.03,17.8 180 top
R433  2201  [R0805]  143.03,22.37 0 top
R434  13  [R1206]  152.3,41.86 180 top
R435  104  [R0805]  174.53,26.75 270 top
R436  47  [V235/17_1MM]  192.56,23.32 90 bottom
R437  47  [V235/17_1MM]  192.56,43.2 270 bottom
R438  100  [R0805]  178.97,26.11 90 top
R439  (101)  [R0805]  178.97,29.29 90 top
R440  2702  [R0805]  167.42,34.88 270 top
R441  104  [R0805]  178.34,39.83 270 top
R442  (1000)  [R0805]  143.03,13.16 0 top
R443  (101)  [R0805]  133.51,29.29 270 top
R444  (1002)  [R0805]  165.77,43.77 0 top
R445  2702  [R0805]  174.78,41.61 270 top
R446  (1002)  [R0805]  133,53.04 90 top
R501  102  [R0805]  108.36,65.63 270 top
R502  13  [R1206]  122.71,66.52 180 top
R503  R_user  [R0805']  113.07,70.59 180 top
R504  R_user  [R0805']  108.87,66.4 270 bottom
R505  4701  [R0805]  167.93,61.19 270 top
R506  13  [R1206]  119.16,70.84 180 top
R507  1002  [R0805]  172.5,61.19 90 top
R508  1002  [R0805]  178.09,67.28 270 top
R509  104  [R0805]  195.23,100.3 90 top
R510  104  [R0805]  195.23,97 90 top
R511  104  [R0805]  195.23,93.7 90 top
R512  102  [R0805]  178.09,70.33 270 top
R513  102  [R0805]  167.67,67.28 90 top
R514  102  [R0805]  167.67,64.24 90 top
R515  100  [R0805]  157.51,71.6 0 top
R516  4701  [R0805]  171.48,73.38 270 top
R517  2702  [R0805]  175.55,73.38 90 top
R518  13  [R1206]  166.41,78.46 180 top
R519  2201  [R0805]  166.4,81.76 90 top
R520  1002  [R0805]  153.7,85.95 180 top
R521  1502  [R0805]  149,60.43 0 top
R522  2702  [R0805]  151.54,60.43 0 top
R523  2702  [R0805]  156.88,60.43 180 top
R524  1002  [R0805]  149.45,74.84 270 top
R525  104  [R0805]  148.05,77.06 270 top
R526  4701  [R0805]  154.72,81.13 0 top
R527  47  [V235/17_1MM]  198.15,75.41 90 bottom
R528  102  [R0805]  188.88,75.67 90 top
R529  47  [V235/17_1MM]  198.15,95.29 90 bottom
R530  104  [R0805]  152.75,77.06 270 top
R531  1502  [R0805]  145.7,69.06 180 top
R532  1002  [R0805]  143.03,70.4 180 top
R533  2201  [R0805]  143.03,74.97 0 top
R534  13  [R1206]  152.3,94.46 180 top
R535  104  [R0805]  174.53,79.35 270 top
R536  47  [V235/17_1MM]  192.56,75.92 90 bottom
R537  47  [V235/17_1MM]  192.56,95.8 270 bottom
R538  100  [R0805]  178.97,78.71 90 top
R539  (101)  [R0805]  178.97,81.89 90 top
R540  2702  [R0805]  167.42,87.48 270 top
R541  104  [R0805]  178.34,92.43 270 top
R542  (1000)  [R0805]  143.03,65.76 0 top
R543  (101)  [R0805]  133.51,81.89 270 top
R544  (1002)  [R0805]  165.77,96.37 0 top
R545  2702  [R0805]  174.78,94.21 270 top
R546  (1002)  [R0805]  133,105.64 90 top
R601  102  [R0805]  108.36,118.23 270 top
R602  13  [R1206]  122.71,119.12 180 top
R603  R_user  [R0805']  113.07,123.19 180 top
R604  R_user  [R0805']  108.87,119 270 bottom
R605  4701  [R0805]  167.93,113.79 270 top
R606  13  [R1206]  119.16,123.44 180 top
R607  1002  [R0805]  172.5,113.79 90 top
R608  1002  [R0805]  178.09,119.88 270 top
R609  104  [R0805]  195.23,152.9 90 top
R610  104  [R0805]  195.23,149.6 90 top
R611  104  [R0805]  195.23,146.3 90 top
R612  102  [R0805]  178.09,122.93 270 top
R613  102  [R0805]  167.67,119.88 90 top
R614  102  [R0805]  167.67,116.84 90 top
R615  100  [R0805]  157.51,124.2 0 top
R616  4701  [R0805]  171.48,125.98 270 top
R617  2702  [R0805]  175.55,125.98 90 top
R618  13  [R1206]  166.41,131.06 180 top
R619  2201  [R0805]  166.4,134.36 90 top
R620  1002  [R0805]  153.7,138.55 180 top
R621  1502  [R0805]  149,113.03 0 top
R622  2702  [R0805]  151.54,113.03 0 top
R623  2702  [R0805]  156.88,113.03 180 top
R624  1002  [R0805]  149.45,127.44 270 top
R625  104  [R0805]  148.05,129.66 270 top
R626  4701  [R0805]  154.72,133.73 0 top
R627  47  [V235/17_1MM]  198.15,128.01 90 bottom
R628  102  [R0805]  188.88,128.27 90 top
R629  47  [V235/17_1MM]  198.15,147.89 90 bottom
R630  104  [R0805]  152.75,129.66 270 top
R631  1502  [R0805]  145.7,121.66 180 top
R632  1002  [R0805]  143.03,123 180 top
R633  2201  [R0805]  143.03,127.57 0 top
R634  13  [R1206]  152.3,147.06 180 top
R635  104  [R0805]  174.53,131.95 270 top
R636  47  [V235/17_1MM]  192.56,128.52 90 bottom
R637  47  [V235/17_1MM]  192.56,148.4 270 bottom
R638  100  [R0805]  178.97,131.31 90 top
R639  (101)  [R0805]  178.97,134.49 90 top
R640  2702  [R0805]  167.42,140.08 270 top
R641  104  [R0805]  178.34,145.03 270 top
R642  (1000)  [R0805]  143.03,118.36 0 top
R643  (101)  [R0805]  133.51,134.49 270 top
R644  (1002)  [R0805]  165.77,148.97 0 top
R645  2702  [R0805]  174.78,146.81 270 top
R646  (1002)  [R0805]  133,158.24 90 top
SJ101  [SJ]  76.24,38.31 180 bottom
SJ201  [SJ]  76.24,90.91 180 bottom
SJ301  [SJ]  76.24,143.51 180 bottom
SJ401  [SJ]  172.24,38.31 180 bottom
SJ501  [SJ]  172.24,90.91 180 bottom
SJ601  [SJ]  172.24,143.51 180 bottom
START  TPSB2.0  [B2.0]  93.01,25.61 0 top
START201  TPSB2.0  [B2.0]  93.01,78.21 0 top
START301  TPSB2.0  [B2.0]  93.01,130.81 0 top
START401  TPSB2.0  [B2.0]  189.01,25.61 0 top
START501  TPSB2.0  [B2.0]  189.01,78.21 0 top
START601  TPSB2.0  [B2.0]  189.01,130.81 0 top
TP1  TPSB2.0  [B2.0]  30.27,11.26 0 top
TP2  TPSB2.0  [B2.0]  21.38,11.89 0 top
TP3  TPSB2.0  [B2.0]  27.41,16.34 0 top
TP4  TPSB2.0  [B2.0]  24.87,21.73 0 top
TP5  TPSB2.0  [B2.0]  27.41,27.13 0 top
TP6  TPSB2.0  [B2.0]  24.87,28.72 0 top
TP7  TPSB2.0  [B2.0]  27.73,34.43 0 top
TP8  TPSB2.0  [B2.0]  24.87,35.7 0 top
TP9  TPSB2.0  [B2.0]  30.27,39.51 0 top
TP10  TPSB2.0  [B2.0]  24.87,42.05 0 top
TP11  TPSB2.0  [B2.0]  30.59,46.5 0 top
TP12  TPSB2.0  [B2.0]  35.67,11.26 0 top
TP13  TPSB2.0  [B2.0]  29.51,49.74 0 top
TP14  TPSB2.0  [B2.0]  30.27,63.85 0 top
TP15  TPSB2.0  [B2.0]  21.38,64.49 0 top
TP16  TPSB2.0  [B2.0]  35.67,14.75 0 top
TP17  TPSB2.0  [B2.0]  35.67,18.24 0 top
TP18  TPSB2.0  [B2.0]  29.95,21.73 0 top
TP19  TPSB2.0  [B2.0]  41.06,24.27 0 top
TP20  TPSB2.0  [B2.0]  27.41,68.94 0 top
TP21  TPSB2.0  [B2.0]  30.27,28.72 0 top
TP22  TPSB2.0  [B2.0]  35.67,32.21 0 top
TP23  TPSB2.0  [B2.0]  35.67,36.34 0 top
TP24  TPSB1,27  [B1,27]  40.75,38.24 0 top
TP25  TPSB2.0  [B2.0]  30.33,42.18 0 top
TP26  TPSB2.0  [B2.0]  30.02,36.78 0 top
TP27  TPSB2.0  [B2.0]  24.87,74.33 0 top
TP28  TPSB2.0  [B2.0]  27.41,79.73 0 top
TP29  TPSB2.0  [B2.0]  24.87,81.32 0 top
TP30  TPSB2.0  [B2.0]  27.73,87.03 0 top
TP31  TPSB2.0  [B2.0]  24.87,88.3 0 top
TP32  TPSB2.0  [B2.0]  30.27,92.11 0 top
TP33  TPSB2.0  [B2.0]  24.87,94.65 0 top
TP34  TPSB2.0  [B2.0]  30.59,99.1 0 top
TP35  TPSB2.0  [B2.0]  35.67,67.35 0 top
TP36  TPSB2.0  [B2.0]  35.67,70.84 0 top
TP37  TPSB2.0  [B2.0]  29.95,74.33 0 top
TP38  TPSB2.0  [B2.0]  41.06,76.87 0 top
TP39  TPSB2.0  [B2.0]  30.27,81.32 0 top
TP40  TPSB2.0  [B2.0]  35.67,84.81 0 top
TP41  TPSB2.0  [B2.0]  35.67,88.94 0 top
TP42  TPSB1,27  [B1,27]  40.75,90.84 0 top
TP43  TPSB2.0  [B2.0]  30.33,94.78 0 top
TP44  TPSB2.0  [B2.0]  30.02,89.38 0 top
TP45  TPSB2.0  [B2.0]  35.67,63.85 0 top
TP46  TPSB2.0  [B2.0]  29.51,102.34 0 top
TP47  TPSB2.0  [B2.0]  30.27,116.45 0 top
TP48  TPSB2.0  [B2.0]  21.38,117.09 0 top
TP49  TPSB2.0  [B2.0]  27.41,121.53 0 top
TP50  TPSB2.0  [B2.0]  24.87,126.93 0 top
TP51  TPSB2.0  [B2.0]  27.41,132.33 0 top
TP52  TPSB2.0  [B2.0]  24.87,133.92 0 top
TP53  TPSB2.0  [B2.0]  27.73,139.63 0 top
TP54  TPSB2.0  [B2.0]  24.87,140.9 0 top
TP55  TPSB2.0  [B2.0]  30.27,144.71 0 top
TP56  TPSB2.0  [B2.0]  24.87,147.25 0 top
TP57  TPSB2.0  [B2.0]  30.59,151.7 0 top
TP58  TPSB2.0  [B2.0]  35.67,119.95 0 top
TP59  TPSB2.0  [B2.0]  35.67,123.44 0 top
TP60  TPSB2.0  [B2.0]  29.95,126.93 0 top
TP61  TPSB2.0  [B2.0]  41.06,129.47 0 top
TP62  TPSB2.0  [B2.0]  30.27,133.92 0 top
TP63  TPSB2.0  [B2.0]  35.67,137.41 0 top
TP64  TPSB2.0  [B2.0]  35.67,141.54 0 top
TP65  TPSB1,27  [B1,27]  40.75,143.44 0 top
TP66  TPSB2.0  [B2.0]  30.33,147.38 0 top
TP67  TPSB2.0  [B2.0]  30.02,141.98 0 top
TP68  TPSB2.0  [B2.0]  35.67,116.45 0 top
TP69  TPSB2.0  [B2.0]  29.51,154.94 0 top
TP139  TPSB2.0  [B2.0]  126.27,11.26 0 top
TP140  TPSB2.0  [B2.0]  117.38,11.89 0 top
TP141  TPSB2.0  [B2.0]  123.41,16.34 0 top
TP142  TPSB2.0  [B2.0]  120.87,21.73 0 top
TP143  TPSB2.0  [B2.0]  123.41,27.13 0 top
TP144  TPSB2.0  [B2.0]  120.87,28.72 0 top
TP145  TPSB2.0  [B2.0]  123.73,34.43 0 top
TP146  TPSB2.0  [B2.0]  120.87,35.7 0 top
TP147  TPSB2.0  [B2.0]  126.27,39.51 0 top
TP148  TPSB2.0  [B2.0]  120.87,42.05 0 top
TP149  TPSB2.0  [B2.0]  126.59,46.5 0 top
TP150  TPSB2.0  [B2.0]  131.67,14.75 0 top
TP151  TPSB2.0  [B2.0]  131.67,18.24 0 top
TP152  TPSB2.0  [B2.0]  125.95,21.73 0 top
TP153  TPSB2.0  [B2.0]  137.06,24.27 0 top
TP154  TPSB2.0  [B2.0]  126.27,28.72 0 top
TP155  TPSB2.0  [B2.0]  131.67,32.21 0 top
TP156  TPSB2.0  [B2.0]  131.67,36.34 0 top
TP157  TPSB1,27  [B1,27]  136.75,38.24 0 top
TP158  TPSB2.0  [B2.0]  126.33,42.18 0 top
TP159  TPSB2.0  [B2.0]  126.02,36.78 0 top
TP160  TPSB2.0  [B2.0]  131.67,11.26 0 top
TP161  TPSB2.0  [B2.0]  125.51,49.74 0 top
TP162  TPSB2.0  [B2.0]  126.27,63.85 0 top
TP163  TPSB2.0  [B2.0]  117.38,64.49 0 top
TP164  TPSB2.0  [B2.0]  123.41,68.94 0 top
TP165  TPSB2.0  [B2.0]  120.87,74.33 0 top
TP166  TPSB2.0  [B2.0]  123.41,79.73 0 top
TP167  TPSB2.0  [B2.0]  120.87,81.32 0 top
TP168  TPSB2.0  [B2.0]  123.73,87.03 0 top
TP169  TPSB2.0  [B2.0]  120.87,88.3 0 top
TP170  TPSB2.0  [B2.0]  126.27,92.11 0 top
TP171  TPSB2.0  [B2.0]  120.87,94.65 0 top
TP172  TPSB2.0  [B2.0]  126.59,99.1 0 top
TP173  TPSB2.0  [B2.0]  131.67,67.35 0 top
TP174  TPSB2.0  [B2.0]  131.67,70.84 0 top
TP175  TPSB2.0  [B2.0]  125.95,74.33 0 top
TP176  TPSB2.0  [B2.0]  137.06,76.87 0 top
TP177  TPSB2.0  [B2.0]  126.27,81.32 0 top
TP178  TPSB2.0  [B2.0]  131.67,84.81 0 top
TP179  TPSB2.0  [B2.0]  131.67,88.94 0 top
TP180  TPSB1,27  [B1,27]  136.75,90.84 0 top
TP181  TPSB2.0  [B2.0]  126.33,94.78 0 top
TP182  TPSB2.0  [B2.0]  126.02,89.38 0 top
TP183  TPSB2.0  [B2.0]  131.67,63.85 0 top
TP184  TPSB2.0  [B2.0]  125.51,102.34 0 top
TP185  TPSB2.0  [B2.0]  126.27,116.45 0 top
TP186  TPSB2.0  [B2.0]  117.38,117.09 0 top
TP187  TPSB2.0  [B2.0]  123.41,121.53 0 top
TP188  TPSB2.0  [B2.0]  120.87,126.93 0 top
TP189  TPSB2.0  [B2.0]  123.41,132.33 0 top
TP190  TPSB2.0  [B2.0]  120.87,133.92 0 top
TP191  TPSB2.0  [B2.0]  123.73,139.63 0 top
TP192  TPSB2.0  [B2.0]  120.87,140.9 0 top
TP193  TPSB2.0  [B2.0]  126.27,144.71 0 top
TP194  TPSB2.0  [B2.0]  120.87,147.25 0 top
TP195  TPSB2.0  [B2.0]  126.59,151.7 0 top
TP196  TPSB2.0  [B2.0]  131.67,119.95 0 top
TP197  TPSB2.0  [B2.0]  131.67,123.44 0 top
TP198  TPSB2.0  [B2.0]  125.95,126.93 0 top
TP199  TPSB2.0  [B2.0]  137.06,129.47 0 top
TP200  TPSB2.0  [B2.0]  126.27,133.92 0 top
TP201  TPSB2.0  [B2.0]  131.67,137.41 0 top
TP202  TPSB2.0  [B2.0]  131.67,141.54 0 top
TP203  TPSB1,27  [B1,27]  136.75,143.44 0 top
TP204  TPSB2.0  [B2.0]  126.33,147.38 0 top
TP205  TPSB2.0  [B2.0]  126.02,141.98 0 top
TP206  TPSB2.0  [B2.0]  131.67,116.45 0 top
TP207  TPSB2.0  [B2.0]  125.51,154.94 0 top
U$1  [CE_10.00]  81.83,6.94 0 bottom
U$2  [CE_10.00]  81.83,59.54 0 bottom
U$3  [CE_10.00]  81.83,112.14 0 bottom
U$7  [CE_10.00]  177.83,6.94 0 bottom
U$8  [CE_10.00]  177.83,59.54 0 bottom
U$9  [CE_10.00]  177.83,112.14 0 bottom
X101  [24-PIN_V2]  76.56,30.5 270 bottom
X102  22-23-2021  [22-23-2021]  16.93,13.16 90 bottom
X103  22-23-2051  [22-23-2051]  26.78,54.44 180 bottom
X201  [24-PIN_V2]  76.56,83.1 270 bottom
X202  22-23-2021  [22-23-2021]  16.93,65.76 90 bottom
X203  22-23-2051  [22-23-2051]  26.78,107.03 180 bottom
X301  [24-PIN_V2]  76.56,135.7 270 bottom
X302  22-23-2021  [22-23-2021]  16.93,118.36 90 bottom
X303  22-23-2051  [22-23-2051]  26.78,159.63 180 bottom
X401  [24-PIN_V2]  172.56,30.5 270 bottom
X402  22-23-2021  [22-23-2021]  112.94,13.16 90 bottom
X403  22-23-2051  [22-23-2051]  122.78,54.44 180 bottom
X501  [24-PIN_V2]  172.56,83.1 270 bottom
X502  22-23-2021  [22-23-2021]  112.94,65.76 90 bottom
X503  22-23-2051  [22-23-2051]  122.78,107.03 180 bottom
X601  [24-PIN_V2]  172.56,135.7 270 bottom
X602  22-23-2021  [22-23-2021]  112.94,118.36 90 bottom
X603  22-23-2051  [22-23-2051]  122.78,159.63 180 bottom

## Tracks (layer width: path | path; a pad name or v marks a point on that pad's centre or on a via)
+10V  (via drill 0.6)  (5 unrouted)
  Top 0.406: 78.53,49.35 76.12,51.77 IC111.3 | 78.66,49.23 IC111.16 79.8,47.32 79.29,47.32 79.29,45.42 80.31,44.91 80.46,44.51 IC104.1 | 76.88,43.39 77.89,42.5 R145.2 | 75.36,49.35 75.23,49.35 74.85,48.97 IC111.13 74.85,45.55 75.61,44.91 76.88,43.77 76.88,43.39 | 75.36,49.35 78.53,49.35 | 78.53,49.35 78.66,49.23 | IC110.4 71.42,41.35 72.43,40.34 v72.94,40.34 74.09,40.34 75.23,39.2 IC110.8 | C102.1 80.44,51.01 78.66,49.23 | v77.64,43.26 76.88,43.26 76.88,43.39 | IC111.5 73.58,51.51 | 73.58,51.51 73.58,51.13 75.36,49.35 | 73.58,51.51 76.24,51.51 | 78.53,101.95 76.12,104.37 IC211.3 | 78.66,101.83 IC211.16 79.8,99.92 79.29,99.92 79.29,98.02 80.31,97.51 80.46,97.11 IC204.1 | 76.88,95.99 77.89,95.1 R245.2 | 75.36,101.95 75.23,101.95 74.85,101.57 IC211.13 74.85,98.14 75.61,97.51 76.88,96.37 76.88,95.99 | 75.36,101.95 78.53,101.95 | 78.53,101.95 78.66,101.83 | IC210.4 71.42,93.95 72.43,92.94 v72.94,92.94 74.09,92.94 75.23,91.8 IC210.8 | C202.1 80.44,103.61 78.66,101.83 | v77.64,95.86 76.88,95.86 76.88,95.99 | IC211.5 73.58,104.11 | 73.58,104.11 73.58,103.73 75.36,101.95 | 73.58,104.11 76.24,104.11 | 78.53,154.56 76.12,156.97 IC311.3 | 78.66,154.43 IC311.16 79.8,152.52 79.29,152.52 79.29,150.62 80.31,150.11 80.46,149.71 IC304.1 | 76.88,148.59 77.89,147.7 R345.2 | 75.36,154.56 75.23,154.56 74.85,154.17 IC311.13 74.85,150.75 75.61,150.11 76.88,148.97 76.88,148.59 | 75.36,154.56 78.53,154.56 | 78.53,154.56 78.66,154.43 | IC310.4 71.42,146.55 72.43,145.54 v72.94,145.54 74.09,145.54 75.23,144.4 IC310.8 | C302.1 80.44,156.21 78.66,154.43 | v77.64,148.46 76.88,148.46 76.88,148.59 | IC311.5 73.58,156.71
  Top 0.406: 73.58,156.71 73.58,156.33 75.36,154.56 | 73.58,156.71 76.24,156.71 | 174.53,49.35 172.12,51.77 IC411.3 | 174.66,49.23 IC411.16 175.8,47.32 175.29,47.32 175.29,45.42 176.31,44.91 176.46,44.51 IC404.1 | 172.88,43.39 173.89,42.5 R445.2 | 171.35,49.35 171.23,49.35 170.85,48.97 IC411.13 170.85,45.55 171.61,44.91 172.88,43.77 172.88,43.39 | 171.35,49.35 174.53,49.35 | 174.53,49.35 174.66,49.23 | IC410.4 167.42,41.35 168.43,40.34 v168.94,40.34 170.08,40.34 171.23,39.2 IC410.8 | C402.1 176.44,51.01 174.66,49.23 | v173.64,43.26 172.88,43.26 172.88,43.39 | IC411.5 169.58,51.51 | 169.58,51.51 169.58,51.13 171.35,49.35 | 169.58,51.51 172.24,51.51 | 174.53,101.95 172.12,104.37 IC511.3 | 174.66,101.83 IC511.16 175.8,99.92 175.29,99.92 175.29,98.02 176.31,97.51 176.46,97.11 IC504.1 | 172.88,95.99 173.89,95.1 R545.2 | 171.35,101.95 171.23,101.95 170.85,101.57 IC511.13 170.85,98.14 171.61,97.51 172.88,96.37 172.88,95.99 | 171.35,101.95 174.53,101.95 | 174.53,101.95 174.66,101.83 | IC510.4 167.42,93.95 168.43,92.94 v168.94,92.94 170.08,92.94 171.23,91.8 IC510.8 | C502.1 176.44,103.61 174.66,101.83 | v173.64,95.86 172.88,95.86 172.88,95.99 | IC511.5 169.58,104.11 | 169.58,104.11 169.58,103.73 171.35,101.95 | 169.58,104.11 172.24,104.11 | 174.53,154.56 172.12,156.97 IC611.3 | 174.66,154.43 IC611.16 175.8,152.52 175.29,152.52 175.29,150.62 176.31,150.11 176.46,149.71 IC604.1 | 172.88,148.59 173.89,147.7 R645.2 | 171.35,154.56 171.23,154.56 170.85,154.17 IC611.13 170.85,150.75 171.61,150.11 172.88,148.97 172.88,148.59 | 171.35,154.56 174.53,154.56 | 174.53,154.56 174.66,154.43 | IC610.4 167.42,146.55 168.43,145.54 v168.94,145.54 170.08,145.54 171.23,144.4 IC610.8
  Top 0.406: C602.1 176.44,156.21 174.66,154.43 | v173.64,148.46 172.88,148.46 172.88,148.59 | IC611.5 169.58,156.71 | 169.58,156.71 169.58,156.33 171.35,154.56 | 169.58,156.71 172.24,156.71
  Bottom 0.406: v77.64,43.26 77.64,42.5 75.48,40.34 v72.94,40.34 | v77.64,95.86 77.64,95.1 75.48,92.94 v72.94,92.94 | v77.64,148.46 77.64,147.7 75.48,145.54 v72.94,145.54 | v173.64,43.26 173.64,42.5 171.48,40.34 v168.94,40.34 | v173.64,95.86 173.64,95.1 171.48,92.94 v168.94,92.94 | v173.64,148.46 173.64,147.7 171.48,145.54 v168.94,145.54
  pour Top: 73.58,51.77 81.07,51.77 81.07,45.8 79.67,45.8 79.67,48.34 79.29,48.72 73.7,48.72 73.7,51.64
  pour Top: 73.58,104.37 81.07,104.37 81.07,98.4 79.67,98.4 79.67,100.94 79.29,101.32 73.7,101.32 73.7,104.24
  pour Top: 73.58,156.97 81.07,156.97 81.07,151 79.67,151 79.67,153.54 79.29,153.92 73.7,153.92 73.7,156.84
  pour Top: 169.58,51.77 177.07,51.77 177.07,45.8 175.67,45.8 175.67,48.34 175.29,48.72 169.7,48.72 169.7,51.64
  pour Top: 169.58,104.37 177.07,104.37 177.07,98.4 175.67,98.4 175.67,100.94 175.29,101.32 169.7,101.32 169.7,104.24
  pour Top: 169.58,156.97 177.07,156.97 177.07,151 175.67,151 175.67,153.54 175.29,153.92 169.7,153.92 169.7,156.84
+12V  (via drill 0.5, 0.6)  (23 unrouted)
  Top 0.35: 20,21.67 20.11,21.16 | 20,74.27 20.11,73.76 | 20,126.87 20.11,126.36 | 116,21.67 116.11,21.16 | 116,74.27 116.11,73.76 | 116,126.87 116.11,126.36
  Top 0.406: IC105.16 18.2,49.86 v18.2,52.66 | R102.1 26.71,14.81 25.95,15.57 R106.1 v25.44,19.76 21.51,19.76 20.11,21.16 | IC102.3 44.72,7.85 43.99,8.33 IC103.IN | R111.2 101.9,41.1 | R110.2 101.9,44.4 | 83.48,44.91 IC104.3 | R135.1 79.42,27.77 78.53,28.02 | IC106.2 96.06,42.88 96.18,42.75 | R109.2 101.9,47.7 | IC107.9 19.37,22.43 20,21.67 | D101.C 92.25,29.67 | 60.5,49.48 60.25,49.48 60,49.74 55.59,49.74 Q105.3 | Q104.3 100.14,28.9 99.37,29.67 | IC205.16 18.2,102.46 v18.2,105.26 | R202.1 26.71,67.41 25.95,68.17 R206.1 v25.44,72.36 21.51,72.36 20.11,73.76 | IC202.3 44.72,60.45 43.99,60.93 IC203.IN | R211.2 101.9,93.7 | R210.2 101.9,97 | 83.48,97.51 IC204.3 | R235.1 79.42,80.36 78.53,80.62 | IC206.2 96.06,95.48 96.18,95.35 | R209.2 101.9,100.3 | IC207.9 19.37,75.03 20,74.27 | D201.C 92.25,82.27 | 60.5,102.08 60.25,102.08 60,102.34 55.59,102.34 Q205.3 | Q204.3 100.14,81.5 99.37,82.27 | IC305.16 18.2,155.06 v18.2,157.86 | R302.1 26.71,120.01 25.95,120.77 R306.1 v25.44,124.96 21.51,124.96 20.11,126.36 | IC302.3 44.72,113.05 43.99,113.53 IC303.IN | R311.2 101.9,146.3 | R310.2 101.9,149.6 | 83.48,150.11 IC304.3 | R335.1 79.42,132.97 78.53,133.22 | IC306.2 96.06,148.08 96.18,147.95 | R309.2 101.9,152.9 | IC307.9 19.37,127.63 20,126.87 | D301.C 92.25,134.87 | 60.5,154.68 60.25,154.68 60,154.94 55.59,154.94 Q305.3 | Q304.3 100.14,134.1 99.37,134.87 | IC405.16 114.2,49.86 v114.2,52.66 | R402.1 122.71,14.81 121.95,15.57 R406.1 v121.44,19.76 117.51,19.76 116.11,21.16 | IC402.3 140.72,7.85 139.99,8.33 IC403.IN | R411.2 197.9,41.1 | R410.2 197.9,44.4 | 179.48,44.91 IC404.3 | R435.1 175.42,27.77 174.53,28.02 | IC406.2 192.06,42.88 192.18,42.75
  Top 0.406: R409.2 197.9,47.7 | IC407.9 115.37,22.43 116,21.67 | D401.C 188.25,29.67 | 156.5,49.48 156.25,49.48 156,49.74 151.59,49.74 Q405.3 | Q404.3 196.14,28.9 195.37,29.67 | IC505.16 114.2,102.46 v114.2,105.26 | R502.1 122.71,67.41 121.95,68.17 R506.1 v121.44,72.36 117.51,72.36 116.11,73.76 | IC502.3 140.72,60.45 139.99,60.93 IC503.IN | R511.2 197.9,93.7 | R510.2 197.9,97 | 179.48,97.51 IC504.3 | R535.1 175.42,80.36 174.53,80.62 | IC506.2 192.06,95.48 192.18,95.35 | R509.2 197.9,100.3 | IC507.9 115.37,75.03 116,74.27 | D501.C 188.25,82.27 | 156.5,102.08 156.25,102.08 156,102.34 151.59,102.34 Q505.3 | Q504.3 196.14,81.5 195.37,82.27 | IC605.16 114.2,155.06 v114.2,157.86 | R602.1 122.71,120.01 121.95,120.77 R606.1 v121.44,124.96 117.51,124.96 116.11,126.36 | IC602.3 140.72,113.05 139.99,113.53 IC603.IN | R611.2 197.9,146.3 | R610.2 197.9,149.6 | 179.48,150.11 IC604.3 | R635.1 175.42,132.97 174.53,133.22 | IC606.2 192.06,148.08 192.18,147.95 | R609.2 197.9,152.9 | IC607.9 115.37,127.63 116,126.87 | D601.C 188.25,134.87 | 156.5,154.68 156.25,154.68 156,154.94 151.59,154.94 Q605.3 | Q604.3 196.14,134.1 195.37,134.87
  Top 0.5: 39.92,34.37 41.06,34.24 45.26,34.24 | 39.92,86.97 41.06,86.84 45.26,86.84 | 39.92,139.57 41.06,139.44 45.26,139.44 | 135.92,34.37 137.06,34.24 141.26,34.24 | 135.92,86.97 137.06,86.84 141.26,86.84 | 135.92,139.57 137.06,139.44 141.26,139.44